# EAGLE design trans1 (EAGLE 6.6.0)
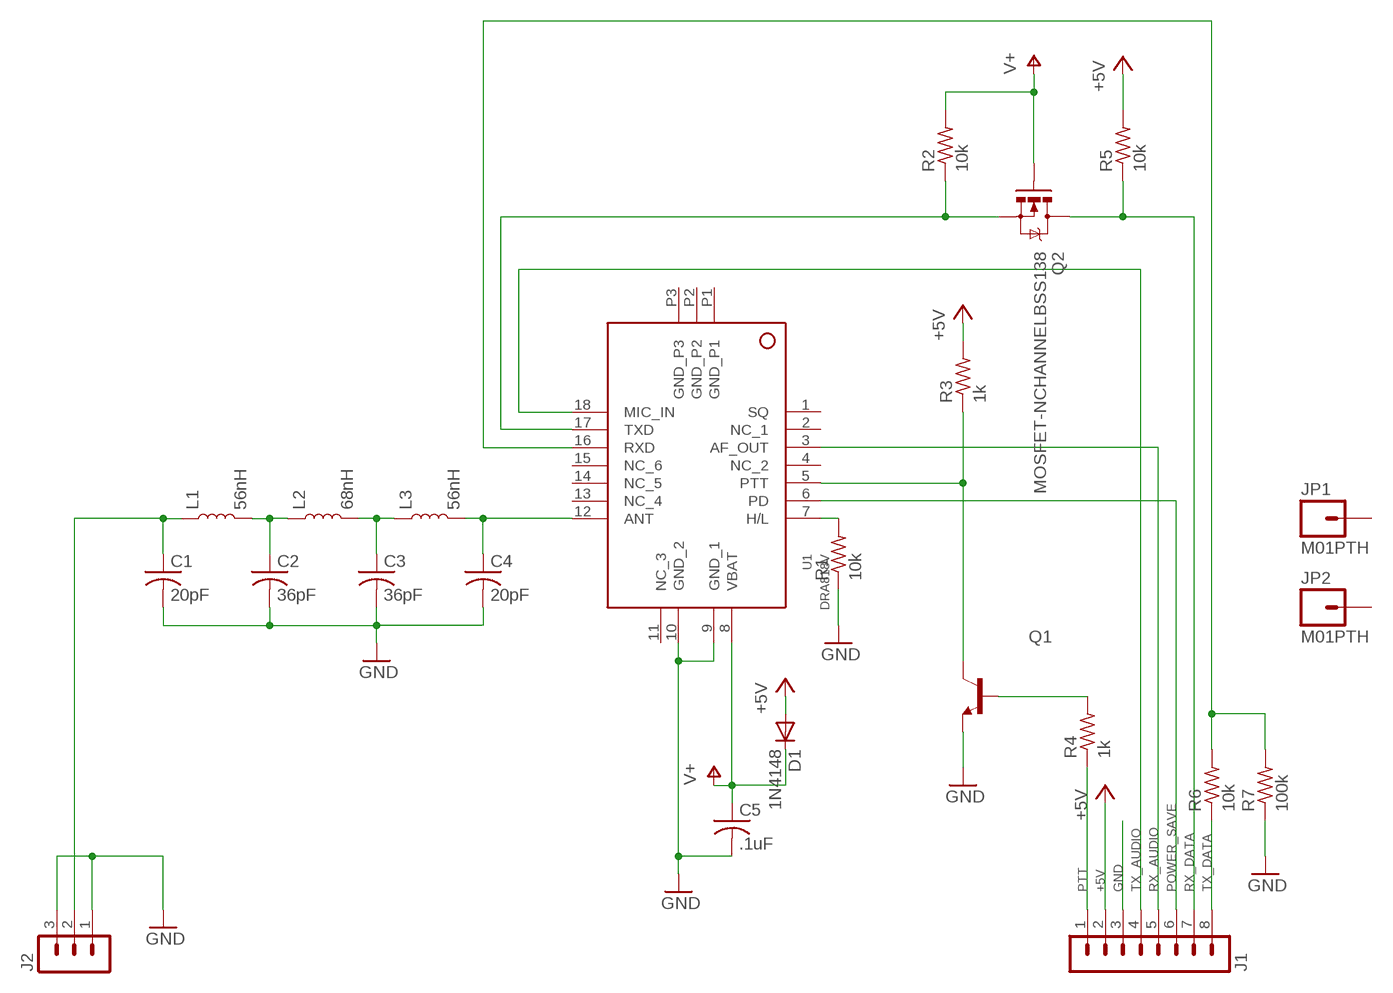
[diagram p0: schematic, sheet 1]

## Parts
C1  20pF  C-USC0805  [C0805]
C2  36pF  C-USC0805  [C0805]
C3  36pF  C-USC0805  [C0805]
C4  20pF  C-USC0805  [C0805]
C5  .1uF  C-USC0805  [C0805]
D1  1N4148  DIODE-SOD123  [SOD123]
J1  MA08-1  [MA08-1]
J2  MA03-1  [MA03-1]
JP1  M01PTH  [1X01]
JP2  M01PTH  [1X01]
L1  56nH  INDUCTOR  [L0805]
L2  68nH  INDUCTOR  [L0805]
L3  56nH  INDUCTOR  [L0805]
Q1  BC817-16LT1SMD  [SOT23-BEC]
Q2  MOSFET-NCHANNELBSS138  [SOT23]
R1  10k  R-US_R0805  [R0805]
R2  10k  R-US_R0805  [R0805]
R3  1k  R-US_R0805  [R0805]
R4  1k  R-US_R0805  [R0805]
R5  10k  R-US_R0805  [R0805]
R6  10k  R-US_R0805  [R0805]
R7  100k  R-US_R0805  [R0805]
U1  DRA818V  [SMD_DRA818]

## Nets
+5V: D1.A J1.2 R3.2 R5.2
GND: C1.2 C2.2 C3.2 C4.2 C5.2 J1.3 J2.1 J2.3 Q1.E R1.1 R7.1 U1.9(GND_1) U1.10(GND_2)
N$1: Q1.C R3.1 U1.5(PTT)
N$2: R1.2 U1.7(H/L)
N$3: R6.2 R7.2 U1.16(RXD)
N$4: Q2.2(S) R2.1 U1.17(TXD)
N$5: Q1.B R4.2
N$6: C4.1 L3.2 U1.12(ANT)
N$7: C3.1 L2.2 L3.1
N$9: C2.1 L1.2 L2.1
N$10: C1.1 J2.2 L1.1
POWER_SAVE: J1.6 U1.6(PD)
PTT: J1.1 R4.1
RX_AUDIO: J1.5 U1.3(AF_OUT)
RX_DATA: J1.7 Q2.3(D) R5.1
TX_AUDIO: J1.4 U1.18(MIC_IN)
TX_DATA: J1.8 R6.1
V+: C5.1 D1.C Q2.1(G) R2.2 U1.8(VBAT)
Unconnected: JP1.1 JP2.1 U1.1(SQ) U1.2(NC_1) U1.4(NC_2) U1.11(NC_3) U1.13(NC_4) U1.14(NC_5) U1.15(NC_6) U1.P1(GND_P1) U1.P2(GND_P2) U1.P3(GND_P3)

## Library data of the parts
C1 C4 = resistor:C-US: CAPACITOR, American symbol; DIGIKEY: ‎712-1381-1-ND‎
C2 C3 = resistor:C-US: CAPACITOR, American symbol; DIGIKEY: 478-10473-1-ND
C5 = resistor:C-US: CAPACITOR, American symbol
D1 = custom-ds:DIODE-: DIODE
J1 = con-lstb:MA08-1: PIN HEADER; OC_FARNELL: unknown; OC_NEWARK: unknown
J2 = con-lstb:MA03-1: PIN HEADER; OC_FARNELL: unknown; OC_NEWARK: unknown
JP1 JP2 = SparkFun-Connectors:M01: Header 1 Standard 1-pin 0.1" header. Use with straight break away headers (SKU : PRT-00116), right angle break away headers (PRT-00553), swiss pins (PRT-00743), machine pins (PRT-00117), and female headers (PRT-00115).
L1 L3 = custom-ds:INDUCTOR: Inductors; DIGIKEY: 535-11570-1-ND; VALUE: 1µH
L2 = custom-ds:INDUCTOR: Inductors; DIGIKEY: ‎535-11572-1-ND‎; VALUE: 1µH
Q1 = transistor-npn:BC817*: NPN Transistor; DIGIKEY: MMBT2222AFSCT-ND
Q2 = SparkFun-DiscreteSemi:MOSFET-NCHANNEL: Common NMOSFET Parts MFG P/N Store ID Prod ID FDD8780 TRANS-09984 SI7820DN TRANS-11055 FDS6630A IC-08089 2N7002PW TRANS-11151 FQP30N06L COM-10213 TRANS-10060 BSS123LT1G TRANS-08345 BSS138 TRANS-00830 BS170 2N7000; PROD_ID: TRANS-00830
R1-R7 = resistor:R-US_: RESISTOR, American symbol
U1 = custom-ds:DRA818V: DRA818V is a compact wireless voice transceiver from Dorji. http://www.dorji.com/pro/Modules/Audio_voice_transceiver.html

## Board
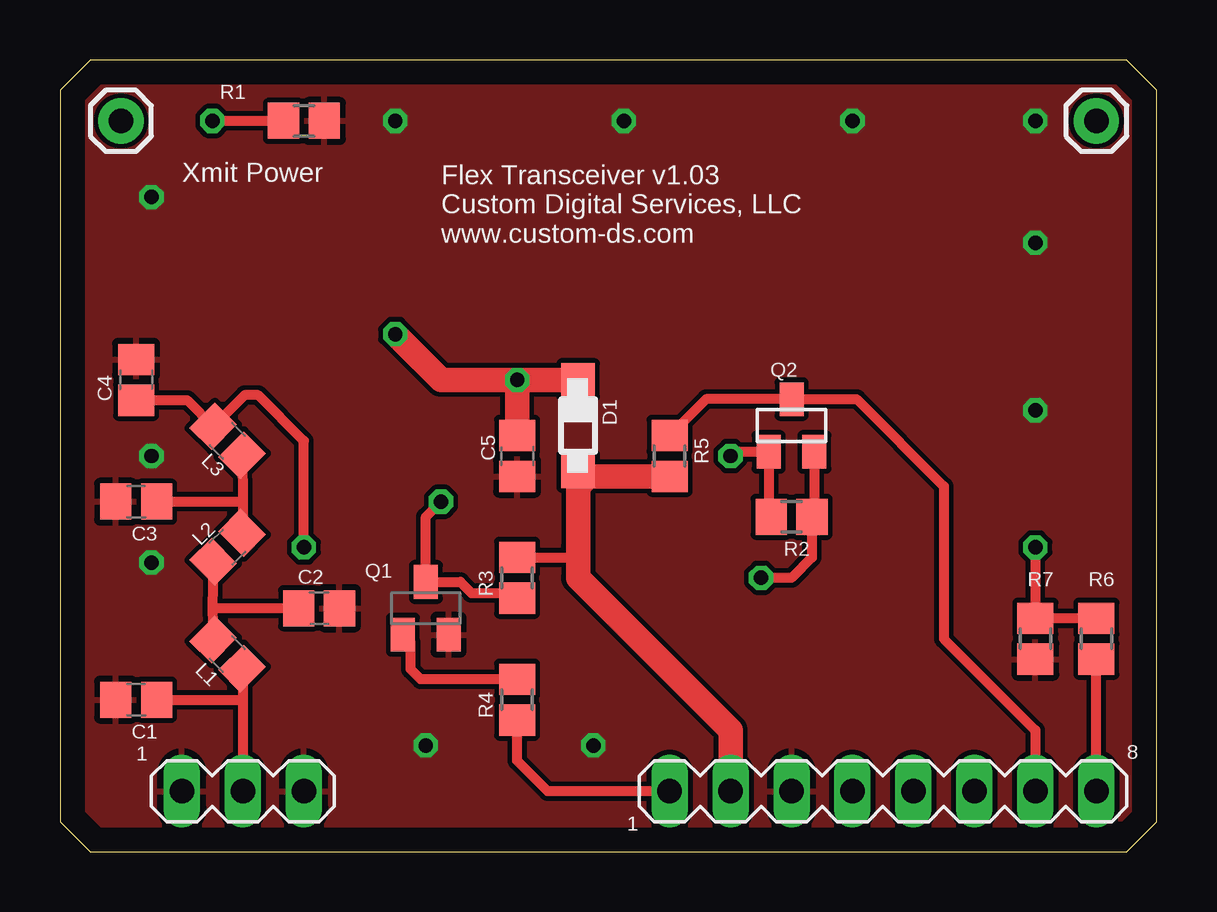
[diagram p1: board, top side]
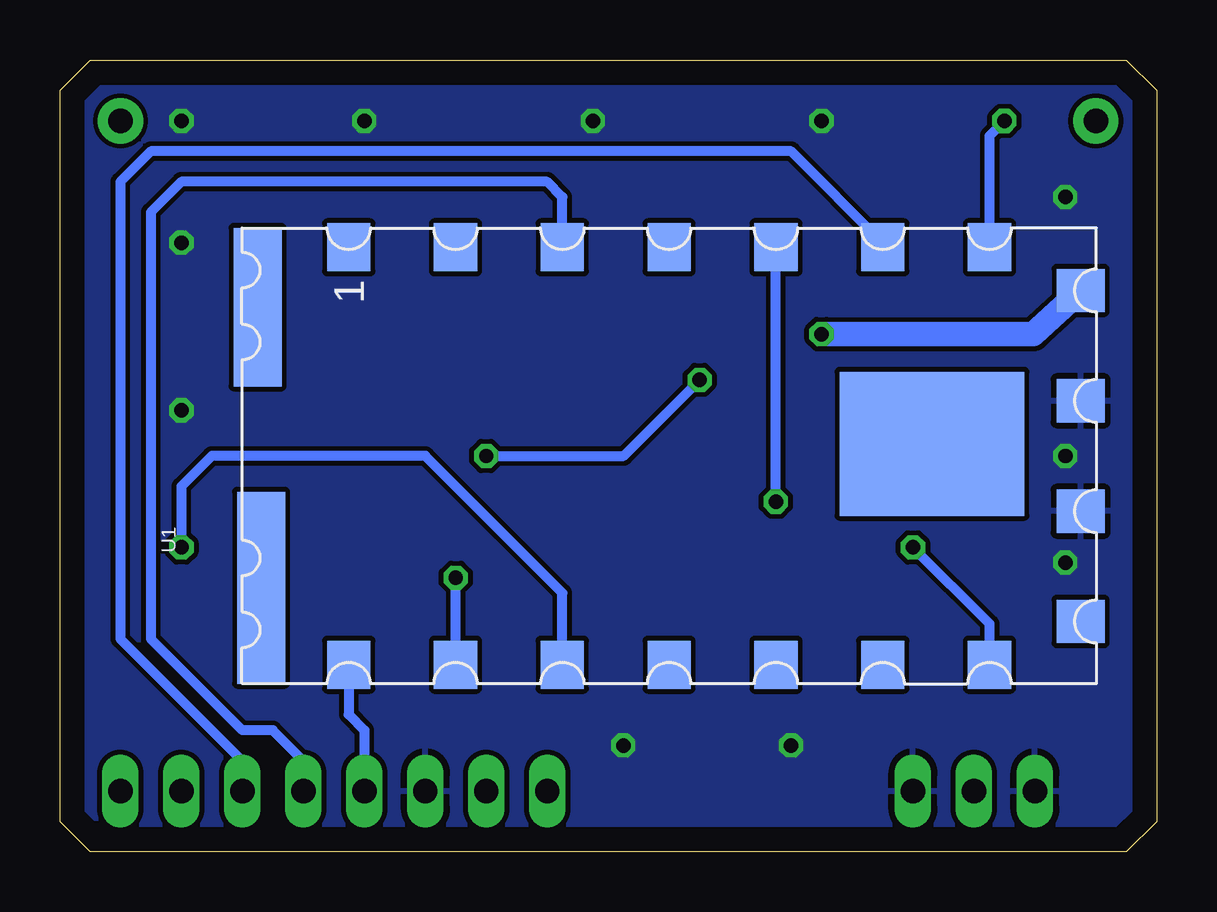
[diagram p2: board, bottom side, seen from below]

Size 45.7 x 33.02 mm. Coordinates in mm from the lower left corner, seen from the top.
Outline: 1.27,0 44.45,0 45.7,1.25 45.7,31.77 44.45,33.02 1.27,33.02 0,31.75 0,1.27 1.27,0
Copper layers (1*16): Top 0.035mm / dielectric 1.5mm / Bottom 0.035mm
Design rules "default *": minimum track width 10mil, minimum drill 23mil, track to track 8mil, track to pad 8mil, pad to pad 8mil, via to via 8mil, smd to smd 8mil, copper to edge 40mil, drill to drill 8mil, minimum pad ring 10mil, minimum via ring 8mil, stop-mask expansion 4mil, vias tented up to drill 0mil, thermal gap 10mil

### Footprints (pad centres in the part's own frame; a part is rotated, then mirrored left to right if it is on the bottom)
C0805 = smd 1.3 x 1.5: 1 -0.85,0; 2 0.85,0
SOD123 = smd 1.4 x 1.4: A 1.9,0; C -1.9,0
MA08-1 = drill 1.016 long: 1 -8.89,0; 2 -6.35,0; 3 -3.81,0; 4 -1.27,0; 5 1.27,0; 6 3.81,0; 7 6.35,0; 8 8.89,0
MA03-1 = drill 1.016 long: 1 -2.54,0; 2 0,0; 3 2.54,0
1X01 = drill 1.016 pad 1.88: 1 0,0
L0805 = smd 1.3 x 1.5: 1 -0.85,0; 2 0.85,0
SOT23-BEC = smd 1 x 1.4: B -0.95,-1.1; C 0,1.1; E 0.95,-1.1
SOT23 = smd 1 x 1.4: 1 -0.95,-1.1; 2 0.95,-1.1; 3 0,1.1
R0805 = smd 1.3 x 1.5: 1 -0.85,0; 2 0.85,0
SMD_DRA818 = smd 1.8 x 2: 1 -13.35,8.7; 2 -8.9,8.7; 3 -4.45,8.7; 4 0,8.7; 5 4.45,8.7; 6 8.9,8.7; 7 13.35,8.7; 12 13.35,-8.7; 13 8.9,-8.7; 14 4.45,-8.7; 15 0,-8.7; 16 -4.45,-8.7; 17 -8.9,-8.7; 18 -13.35,-8.7 | smd 2 x 1.8: 8 17.145,6.9; 9 17.145,2.3; 10 17.145,-2.3; 11 17.145,-6.9 | smd 7.7 x 6: P1 10.95,0.5 | smd 2 x 6.6: P2 -17.145,6.2 | smd 2 x 8: P3 -17,-5.5

### Placement (x,y rotation side)
C1  3.17,6.35 180 top
C2  10.79,10.16 0 top
C3  3.17,14.61 180 top
C4  3.17,19.68 90 top
C5  19.05,16.51 270 top
D1  21.59,17.78 270 top
J1  34.29,2.54 0 top
J2  7.62,2.54 0 top
JP1  43.18,30.48 0 top
JP2  2.54,30.48 0 top
L1  6.99,8.26 135 top
L2  6.99,12.7 45 top
L3  6.99,17.14 135 top
Q1  15.24,10.16 0 top
Q2  30.48,17.78 0 top
R1  10.16,30.48 180 top
R2  30.48,13.97 180 top
R3  19.05,11.43 90 top
R4  19.05,6.35 90 top
R5  25.4,16.51 270 top
R6  43.18,8.89 90 top
R7  40.64,8.89 90 top
U1  20.32,16.51 0 bottom

### Tracks (layer width: path | path; a pad name or v marks a point on that pad's centre or on a via)
+5V
  Top 0.406: R3.2 21.17,12.28 21.59,12.7
  Top 1.016: J1.2 27.94,5.08 21.59,11.43 21.59,12.7 21.59,15.24 | D1.A 21.59,15.24 | R5.2 22.01,15.66 21.59,15.24
GND  (via drill 0.6)
  other vias: 40.64,18.41 33.02,30.48 22.23,4.45 3.81,27.3 13.97,30.48 3.81,16.51 3.81,12.06 23.5,30.48 40.64,30.48 40.64,25.4 15.24,4.45
  pour Bottom: 0,31.75 0,1.27 1.27,0 44.45,0 45.72,1.27 45.72,31.75 44.45,33.02 1.27,33.02
  pour Top: 0,31.75 0,1.27 1.27,0 44.45,0 45.72,1.27 45.72,31.75 44.45,33.02 1.27,33.02
N$1  (via drill 0.6)
  Top 0.406: R3.1 18.84,10.79 17.14,10.79 16.68,11.26 Q1.C 15.24,13.97 v15.88,14.61
  Bottom 0.406: v15.88,14.61 U1.5
N$2  (via drill 0.6)
  Top 0.406: v6.35,30.48 R1.2
  Bottom 0.406: U1.7 6.97,29.86 v6.35,30.48
N$3  (via drill 0.6)
  Top 0.406: R6.2 R7.2 v40.64,12.7
  Bottom 0.406: U1.16 24.77,10.8 30.48,16.51 39.37,16.51 40.64,15.24 v40.64,12.7
N$4  (via drill 0.6)
  Top 0.406: v29.21,11.43 30.48,11.43 31.33,12.28 R2.1 31.43,14.07 Q2.2
  Bottom 0.406: U1.17 v29.22,11.42 v29.21,11.43
N$5
  Top 0.406: R4.2 15.03,7.2 14.61,7.62 14.61,8.74 Q1.B
N$6  (via drill 0.6)
  Top 0.406: C4.1 5.29,18.84 L3.2 7.69,19.05 8.26,19.05 10.16,17.14 v10.16,12.7
  Bottom 0.406: U1.12 6.97,9.51 v10.16,12.7
N$7
  Top 0.406: L3.1 7.62,14.61 | 7.62,14.61 L2.2 | C3.1 7.62,14.61
N$9
  Top 0.406: L2.1 6.35,10.16 | 6.35,10.16 L1.2 | C2.1 6.35,10.16
N$10
  Top 0.406: L1.1 7.62,6.35 | 7.62,6.35 J2.2 | C1.1 7.62,6.35
POWER_SAVE
  Bottom 0.406: U1.6 11.42,25.39 15.24,29.21 41.91,29.21 43.18,27.94 43.18,8.89 38.1,3.81 J1.6
PTT
  Top 0.406: J1.1 20.32,2.54 19.05,3.81 R4.1
RX_AUDIO
  Bottom 0.406: U1.3 24.77,27.31 25.4,27.94 40.64,27.94 41.91,26.67 41.91,8.89 38.1,5.08 36.83,5.08 35.56,3.81 J1.5
RX_DATA
  Top 0.406: R5.1 26.92,18.88 Q2.3 33.19,18.88 36.83,15.24 36.83,8.89 40.64,5.08 J1.7
TX_AUDIO
  Bottom 0.406: U1.18 33.67,5.73 33.02,5.08 J1.4
TX_DATA
  Top 0.406: J1.8 R6.1
V+  (via drill 0.6)
  Top 0.406: R2.2 29.53,14.07 Q2.1 28.11,16.68 v27.94,16.51
  Top 1.016: D1.C v19.05,19.68 | v19.05,19.68 15.88,19.68 v13.97,21.59 | C5.1 v19.05,19.68
  Bottom 0.406: v27.94,16.51 22.22,16.51 v19.05,19.68
  Bottom 1.016: v13.97,21.59 5.14,21.59 U1.8

### Text on the board
tNames: Xmit Power | Flex Transceiver v1.03 / Custom Digital Services, LLC / www.custom-ds.com